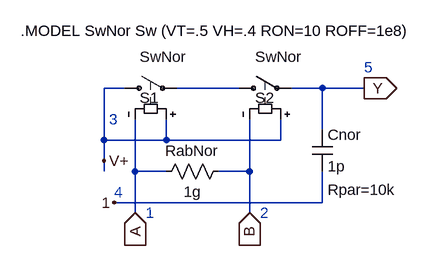
[diagram p0: schematic NorH0.asc]
NorH0.asc, the LTspice schematic file:
Version 4
SHEET 1 880 680
WIRE -48 304 -48 224
WIRE -48 336 -48 304
WIRE -48 352 -48 336
WIRE -16 224 -48 224
WIRE 0 352 0 272
WIRE 0 416 0 352
WIRE 48 304 -48 304
WIRE 48 304 48 272
WIRE 48 352 0 352
WIRE 160 224 64 224
WIRE 176 352 128 352
WIRE 176 352 176 272
WIRE 176 416 176 352
WIRE 224 304 48 304
WIRE 224 304 224 272
WIRE 288 224 240 224
WIRE 288 288 288 224
WIRE 288 400 -32 400
WIRE 288 400 288 352
WIRE 352 224 288 224
FLAG 352 224 Y
IOPIN 352 224 Out
FLAG 0 416 A
IOPIN 0 416 In
FLAG 176 416 B
IOPIN 176 416 In
FLAG -32 400 1
FLAG -48 336 V+
SYMBOL sw -32 224 R270
WINDOW 0 -15 39 VRight 0
WINDOW 3 48 39 VRight 0
SYMATTR InstName S1
SYMATTR Value SwNor
SYMBOL sw 144 224 R270
WINDOW 0 -15 41 VRight 0
WINDOW 3 48 41 VRight 0
SYMATTR InstName S2
SYMATTR Value SwNor
SYMBOL res 144 336 R90
WINDOW 0 0 56 VBottom 0
WINDOW 3 32 56 VTop 0
SYMATTR InstName RabNor
SYMATTR Value 1g
SYMBOL cap 272 288 R0
WINDOW 39 24 92 Left 0
SYMATTR SpiceLine Rpar=10k
SYMATTR InstName Cnor
SYMATTR Value 1p
TEXT 16 416 Left 0 ;1
TEXT 192 416 Left 0 ;2
TEXT 352 192 Left 0 ;5
TEXT -176 136 Left 0 !.MODEL SwNor Sw (VT=.5 VH=.4 RON=10 ROFF=1e8)
TEXT -40 272 Left 0 ;3
TEXT -32 384 Left 0 ;4

The netlist it stands for:
* NorH0.asc
S1 V+ N001 V+ A SwNor
S2 N001 Y V+ B SwNor
RabNor B A 1g
Cnor Y 1 1p Rpar=10k
* 1
* 2
* 5
.MODEL SwNor Sw (VT=.5 VH=.4 RON=10 ROFF=1e8)
* 3
* 4
.backanno
.end